# EAGLE design Parallel Charger (EAGLE 5.11)
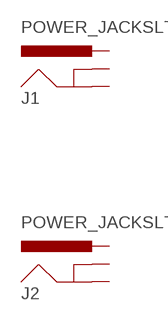
[diagram p0: schematic, sheet 1]

## Parts
J1  POWER_JACKSLT  [POWER_JACK_SLOT]
J2  POWER_JACKSLT  [POWER_JACK_SLOT]
Unconnected: J1.GND@1(GNDBREAK) J1.GND@2(GND) J1.PWR J2.GND@1(GNDBREAK) J2.GND@2(GND) J2.PWR

## Library data of the parts
J1 J2 = SparkFun:POWER_JACK: Power Jack This is the standard 5.5mm barrel jack for power. The PTH is the most common, proven, reliable, footprint. All others are experimental. The Slot footprint only works if the mill layer is transmitted to the PCB fab house so be warned. Spark Fun Electronics SKU : PRT-00119. Mating wall wart : TOL-00298 (and others)

## Board
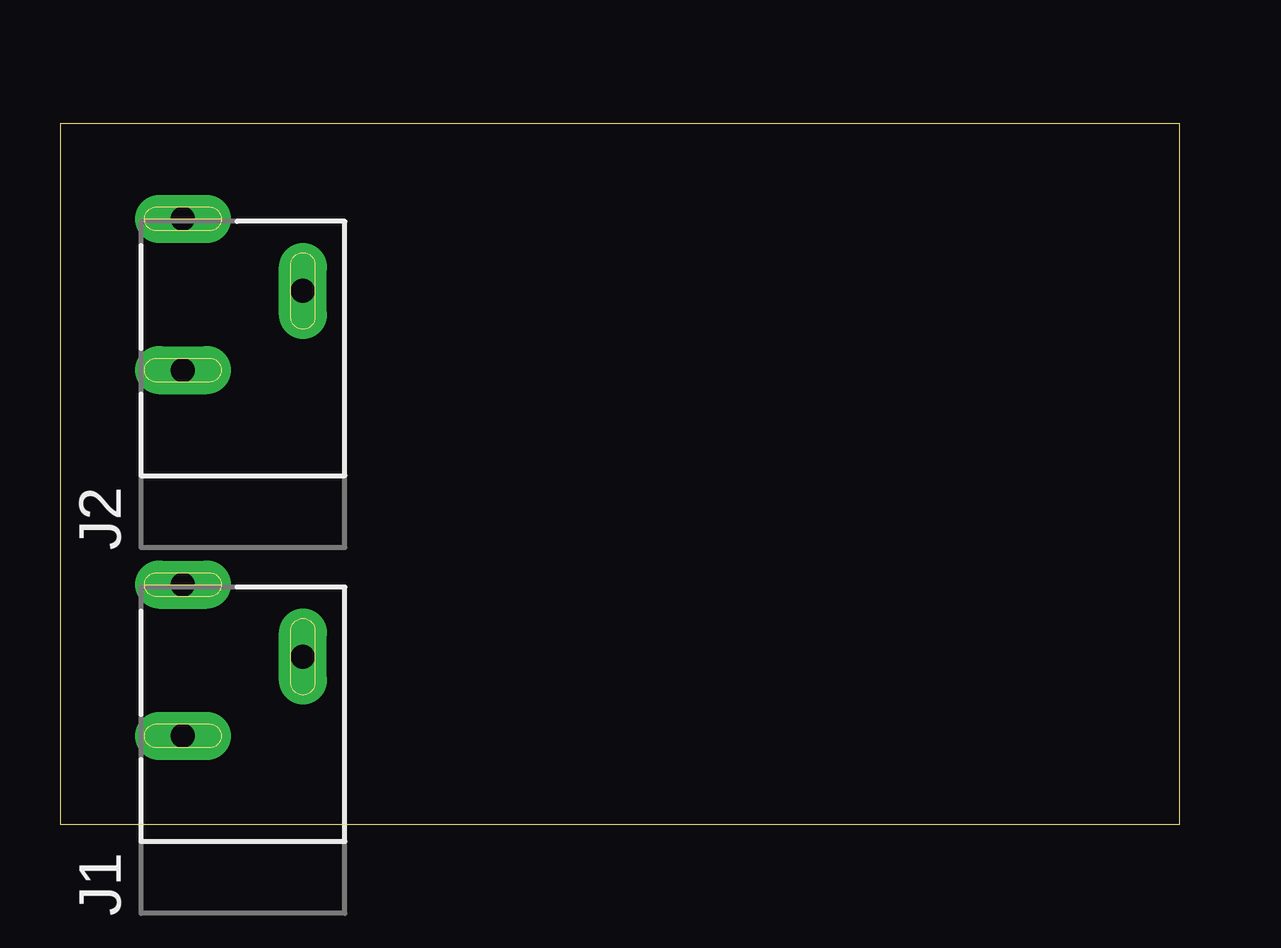
[diagram p1: board, top side]
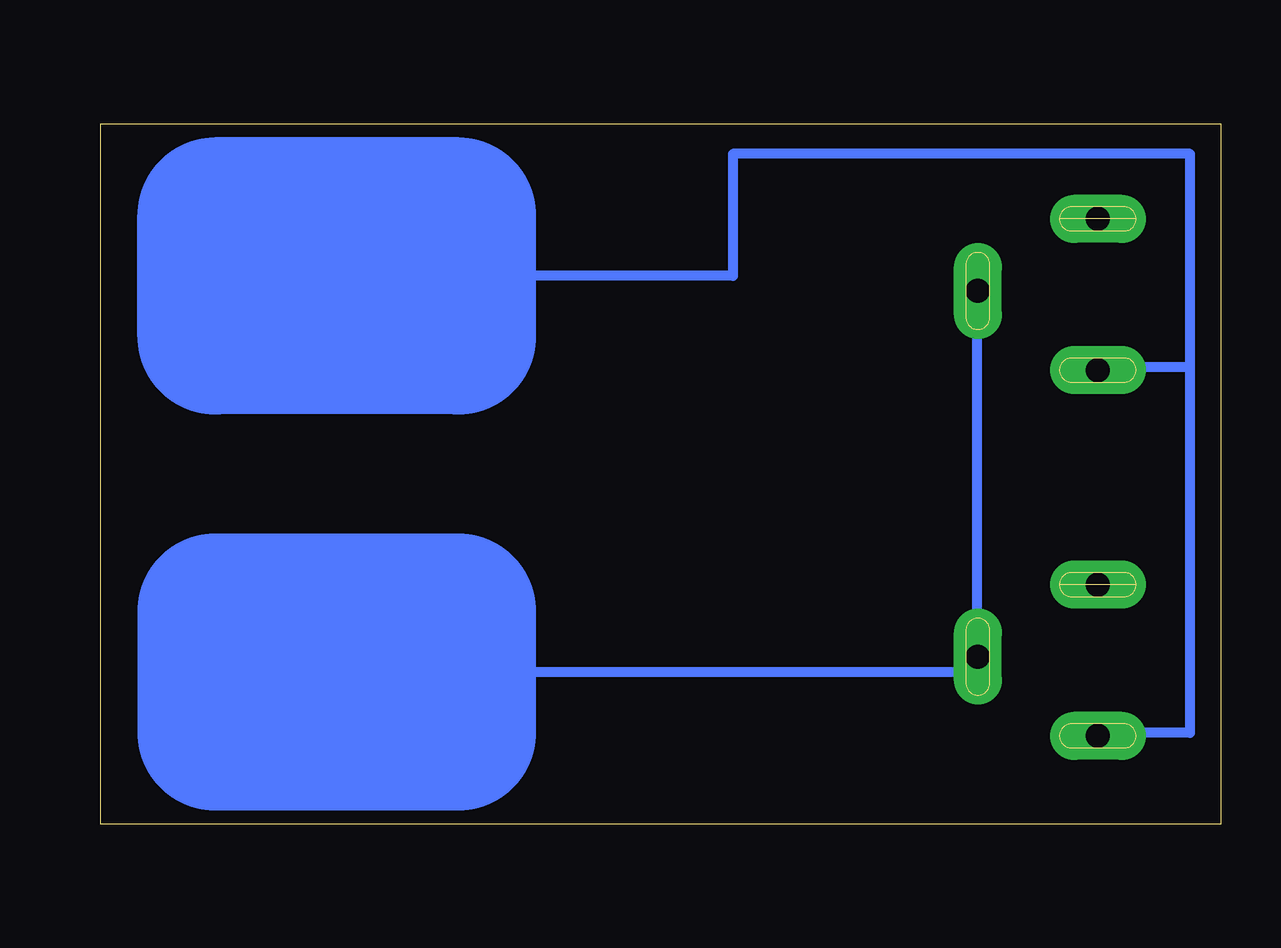
[diagram p2: board, bottom side, seen from below]

Size 46.66 x 29.2 mm. Coordinates in mm from the lower left corner, seen from the top.
Outline: 0,0 46.66,0 46.66,29.2 0,29.2 0,0
Copper layers (1*16): Top 0.035mm / dielectric 1.5mm / Bottom 0.035mm
Design rules "default": minimum track width 10mil, minimum drill 24mil, track to track 8mil, track to pad 8mil, pad to pad 8mil, via to via 8mil, smd to smd 8mil, copper to edge 40mil, drill to drill 8mil, minimum pad ring 10mil, minimum via ring 8mil, stop-mask expansion 4mil, vias tented up to drill 0mil, thermal gap 10mil

### Footprints (pad centres in the part's own frame; a part is rotated, then mirrored left to right if it is on the bottom)
POWER_JACK_SLOT = drill 1 pad 2 long: GND@1 2.58,7.5; GND@2 7.58,10.8; PWR 2.58,13.8

### Placement (x,y rotation side)
J1  2.54,-3.81 0 top
J2  2.54,11.43 0 top

### Tracks (layer width: path | path; a pad name or v marks a point on that pad's centre or on a via)
N$1
  Bottom 0.406: 10.16,22.86 10.16,6.35 43.18,6.35 | 43.18,6.35 43.18,11.43 31.75,11.43 31.75,8.89 | 31.75,3.81 31.75,1.27 43.18,1.27 43.18,6.35
  Bottom 6.452: 31.75,8.89 41.91,8.89 41.91,3.81 31.75,3.81 31.75,8.89
N$2
  Bottom 0.406: 31.75,25.4 31.75,27.94 43.18,27.94 43.18,17.78 31.75,17.78 31.75,20.32
  Bottom 6.452: 31.75,25.4 41.91,25.4 41.91,20.32 31.75,20.32 31.75,25.4
N$3
  Bottom 0.406: 1.27,19.05 5.08,19.05 | 1.27,19.05 1.27,27.94 20.32,27.94 20.32,22.86 29.21,22.86 | 5.08,3.81 1.27,3.81 1.27,19.05